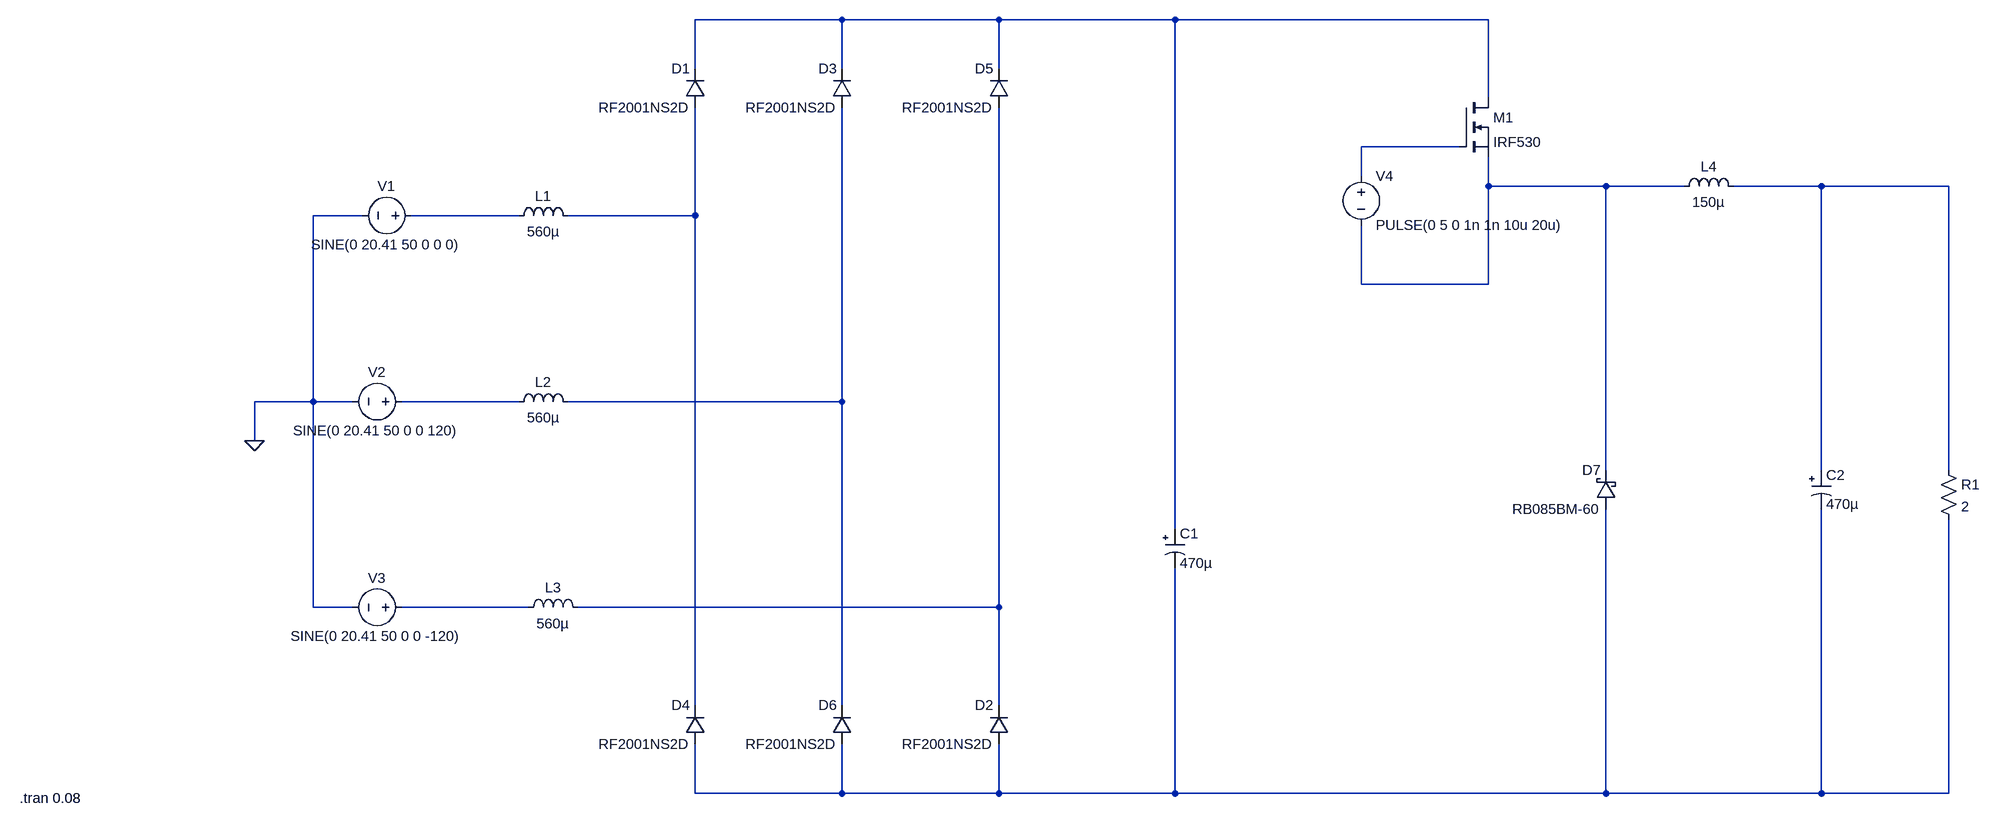
[diagram p0: schematic term-project simulation.asc]
term-project simulation.asc, the LTspice schematic file:
Version 4
SHEET 1 2184 748
WIRE 320 -544 80 -544
WIRE 576 -544 320 -544
WIRE 864 -544 576 -544
WIRE 1376 -544 864 -544
WIRE 80 -464 80 -544
WIRE 320 -464 320 -544
WIRE 576 -464 576 -544
WIRE 1376 -416 1376 -544
WIRE 1328 -336 1168 -336
WIRE 1168 -288 1168 -336
WIRE 1376 -272 1376 -320
WIRE 1568 -272 1376 -272
WIRE 1696 -272 1568 -272
WIRE 1920 -272 1776 -272
WIRE 2128 -272 1920 -272
WIRE -464 -224 -544 -224
WIRE -208 -224 -384 -224
WIRE 80 -224 80 -400
WIRE 80 -224 -128 -224
WIRE 1168 -112 1168 -208
WIRE 1376 -112 1376 -272
WIRE 1376 -112 1168 -112
WIRE -544 80 -544 -224
WIRE -544 80 -640 80
WIRE -480 80 -544 80
WIRE -208 80 -400 80
WIRE 320 80 320 -400
WIRE 320 80 -128 80
WIRE -640 144 -640 80
WIRE 1568 192 1568 -272
WIRE 1920 192 1920 -272
WIRE 2128 192 2128 -272
WIRE 864 288 864 -544
WIRE -544 416 -544 80
WIRE -480 416 -544 416
WIRE -192 416 -400 416
WIRE 576 416 576 -400
WIRE 576 416 -112 416
WIRE 80 576 80 -224
WIRE 320 576 320 80
WIRE 576 576 576 416
WIRE 80 720 80 640
WIRE 320 720 320 640
WIRE 320 720 80 720
WIRE 576 720 576 640
WIRE 576 720 320 720
WIRE 864 720 864 352
WIRE 864 720 576 720
WIRE 1568 720 1568 256
WIRE 1568 720 864 720
WIRE 1920 720 1920 256
WIRE 1920 720 1568 720
WIRE 2128 720 2128 272
WIRE 2128 720 1920 720
FLAG -640 144 0
SYMBOL voltage -368 -224 R90
WINDOW 0 -32 56 VBottom 2
WINDOW 3 32 56 VTop 2
WINDOW 123 0 0 Left 0
WINDOW 39 0 0 Left 0
SYMATTR InstName V1
SYMATTR Value SINE(0 20.41 50 0 0 0)
SYMBOL ind -224 -208 R270
WINDOW 0 32 56 VTop 2
WINDOW 3 5 56 VBottom 2
SYMATTR InstName L1
SYMATTR Value 560µ
SYMATTR SpiceLine Ipk=7 Rser=0.0774 Rpar=52752 Cpar=0 mfg="Coilcraft" pn="PCV-2-564-08"
SYMBOL voltage -384 80 R90
WINDOW 0 -32 56 VBottom 2
WINDOW 3 32 56 VTop 2
WINDOW 123 0 0 Left 0
WINDOW 39 0 0 Left 0
SYMATTR InstName V2
SYMATTR Value SINE(0 20.41 50 0 0 120)
SYMBOL voltage -384 416 R90
WINDOW 0 -32 56 VBottom 2
WINDOW 3 32 56 VTop 2
WINDOW 123 0 0 Left 0
WINDOW 39 0 0 Left 0
SYMATTR InstName V3
SYMATTR Value SINE(0 20.41 50 0 0 -120)
SYMBOL diode 96 -400 R180
WINDOW 0 24 64 Left 2
WINDOW 3 24 0 Left 2
SYMATTR InstName D1
SYMATTR Value RF2001NS2D
SYMBOL polcap 848 288 R0
WINDOW 3 24 56 Left 2
SYMATTR Value 470µ
SYMATTR InstName C1
SYMATTR Description Capacitor
SYMATTR Type cap
SYMATTR SpiceLine V=63 Irms=2.225 Rser=0.0272 Lser=8.842n mfg="Würth Elektronik" pn="860080778023 WCAP-ATLI 13x30" type="Al electrolytic"
SYMBOL ind -224 96 R270
WINDOW 0 32 56 VTop 2
WINDOW 3 5 56 VBottom 2
SYMATTR InstName L2
SYMATTR Value 560µ
SYMATTR SpiceLine Ipk=7 Rser=0.0774 Rpar=52752 Cpar=0 mfg="Coilcraft" pn="PCV-2-564-08"
SYMBOL ind -208 432 R270
WINDOW 0 32 56 VTop 2
WINDOW 3 5 56 VBottom 2
SYMATTR InstName L3
SYMATTR Value 560µ
SYMATTR SpiceLine Ipk=7 Rser=0.0774 Rpar=52752 Cpar=0 mfg="Coilcraft" pn="PCV-2-564-08"
SYMBOL nmos 1328 -416 R0
SYMATTR InstName M1
SYMATTR Value IRF530
SYMBOL voltage 1168 -304 R0
WINDOW 123 0 0 Left 0
WINDOW 39 0 0 Left 0
SYMATTR InstName V4
SYMATTR Value PULSE(0 5 0 1n 1n 10u 20u)
SYMBOL schottky 1584 256 R180
WINDOW 0 24 64 Left 2
WINDOW 3 24 0 Left 2
SYMATTR InstName D7
SYMATTR Value RB085BM-60
SYMATTR Description Diode
SYMATTR Type diode
SYMBOL polcap 1904 192 R0
WINDOW 3 24 56 Left 2
SYMATTR InstName C2
SYMATTR Value 470µ
SYMATTR SpiceLine V=50 Irms=1.8 Rser=0.045 Lser=7n mfg="Würth Elektronik" pn="860040675011 WCAP-ATUL 10x30" type="Al electrolytic"
SYMATTR Description Capacitor
SYMATTR Type cap
SYMBOL res 2112 176 R0
SYMATTR InstName R1
SYMATTR Value 2
SYMBOL ind 1680 -256 R270
WINDOW 0 32 56 VTop 2
WINDOW 3 5 56 VBottom 2
SYMATTR InstName L4
SYMATTR Value 150µ
SYMATTR SpiceLine Ipk=9.2 Rser=0.0306 Rpar=35180 Cpar=13.607p mfg="Würth Elektronik" pn="74437529203151 WE-HCF 2920"
SYMBOL diode 592 640 R180
WINDOW 0 24 64 Left 2
WINDOW 3 24 0 Left 2
SYMATTR InstName D2
SYMATTR Value RF2001NS2D
SYMBOL diode 336 -400 R180
WINDOW 0 24 64 Left 2
WINDOW 3 24 0 Left 2
SYMATTR InstName D3
SYMATTR Value RF2001NS2D
SYMBOL diode 96 640 R180
WINDOW 0 24 64 Left 2
WINDOW 3 24 0 Left 2
SYMATTR InstName D4
SYMATTR Value RF2001NS2D
SYMBOL diode 592 -400 R180
WINDOW 0 24 64 Left 2
WINDOW 3 24 0 Left 2
SYMATTR InstName D5
SYMATTR Value RF2001NS2D
SYMBOL diode 336 640 R180
WINDOW 0 24 64 Left 2
WINDOW 3 24 0 Left 2
SYMATTR InstName D6
SYMATTR Value RF2001NS2D
TEXT -1024 728 Left 2 !.tran 0.08

The netlist it stands for:
* term-project simulation.asc
V1 N005 0 SINE(0 20.41 50 0 0 0)
L1 N005 N006 560µ Ipk=7 Rser=0.0774 Rpar=52752 Cpar=0 mfg="Coilcraft" pn="PCV-2-564-08"
V2 N007 0 SINE(0 20.41 50 0 0 120)
V3 N009 0 SINE(0 20.41 50 0 0 -120)
D1 N006 N001 RF2001NS2D
C1 N001 N011 470µ V=63 Irms=2.225 Rser=0.0272 Lser=8.842n mfg="Würth Elektronik" pn="860080778023 WCAP-ATLI 13x30" type="Al electrolytic"
L2 N007 N008 560µ Ipk=7 Rser=0.0774 Rpar=52752 Cpar=0 mfg="Coilcraft" pn="PCV-2-564-08"
L3 N009 N010 560µ Ipk=7 Rser=0.0774 Rpar=52752 Cpar=0 mfg="Coilcraft" pn="PCV-2-564-08"
M1 N001 N002 N003 N003 IRF530
V4 N002 N003 PULSE(0 5 0 1n 1n 10u 20u)
D7 N011 N003 RB085BM-60
C2 N004 N011 470µ V=50 Irms=1.8 Rser=0.045 Lser=7n mfg="Würth Elektronik" pn="860040675011 WCAP-ATUL 10x30" type="Al electrolytic"
R1 N004 N011 2
L4 N003 N004 150µ Ipk=9.2 Rser=0.0306 Rpar=35180 Cpar=13.607p mfg="Würth Elektronik" pn="74437529203151 WE-HCF 2920"
D2 N011 N010 RF2001NS2D
D3 N008 N001 RF2001NS2D
D4 N011 N006 RF2001NS2D
D5 N010 N001 RF2001NS2D
D6 N011 N008 RF2001NS2D
.model D D
.lib standard.dio
.model NMOS NMOS
.model PMOS PMOS
.lib standard.mos
.tran 0.08
.backanno
.end